# EAGLE schematic Electronics_Design_v1 v11 (EAGLE 9.7.0)
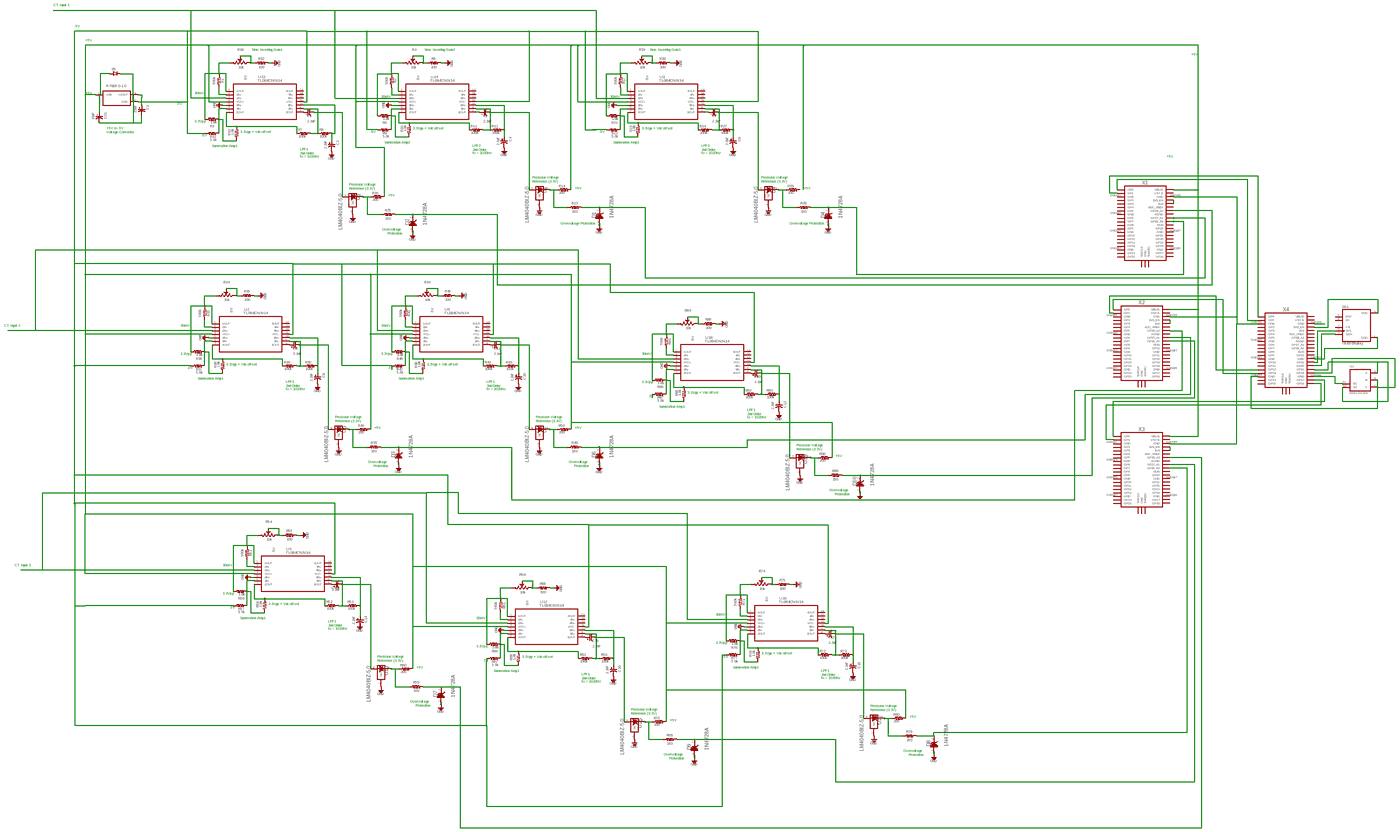
[diagram p0: schematic, sheet 1, overview]
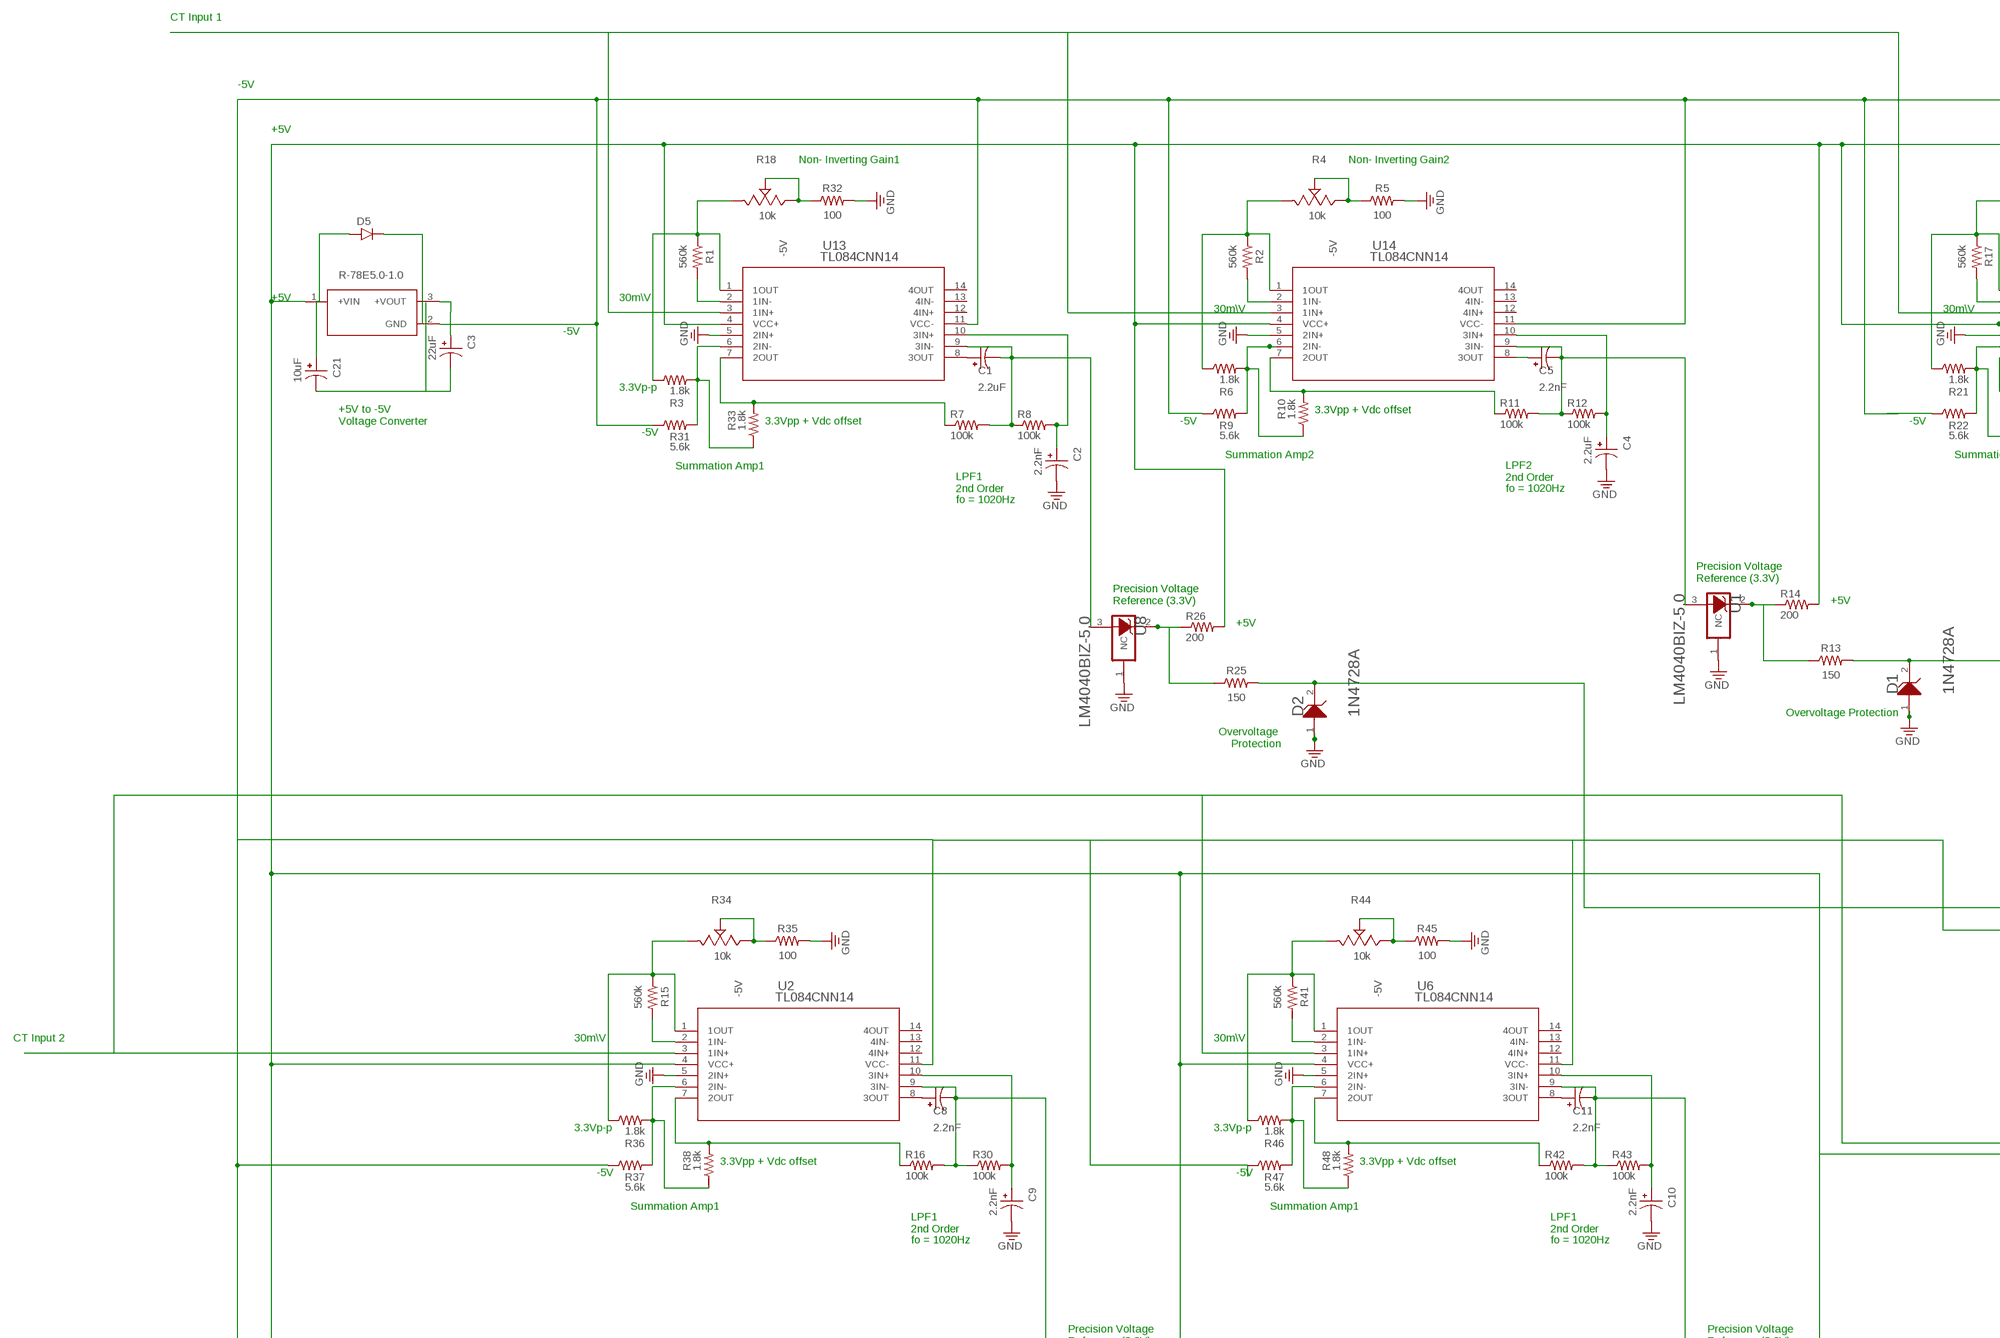
[diagram p1: schematic, sheet 1, part 1 of 6]
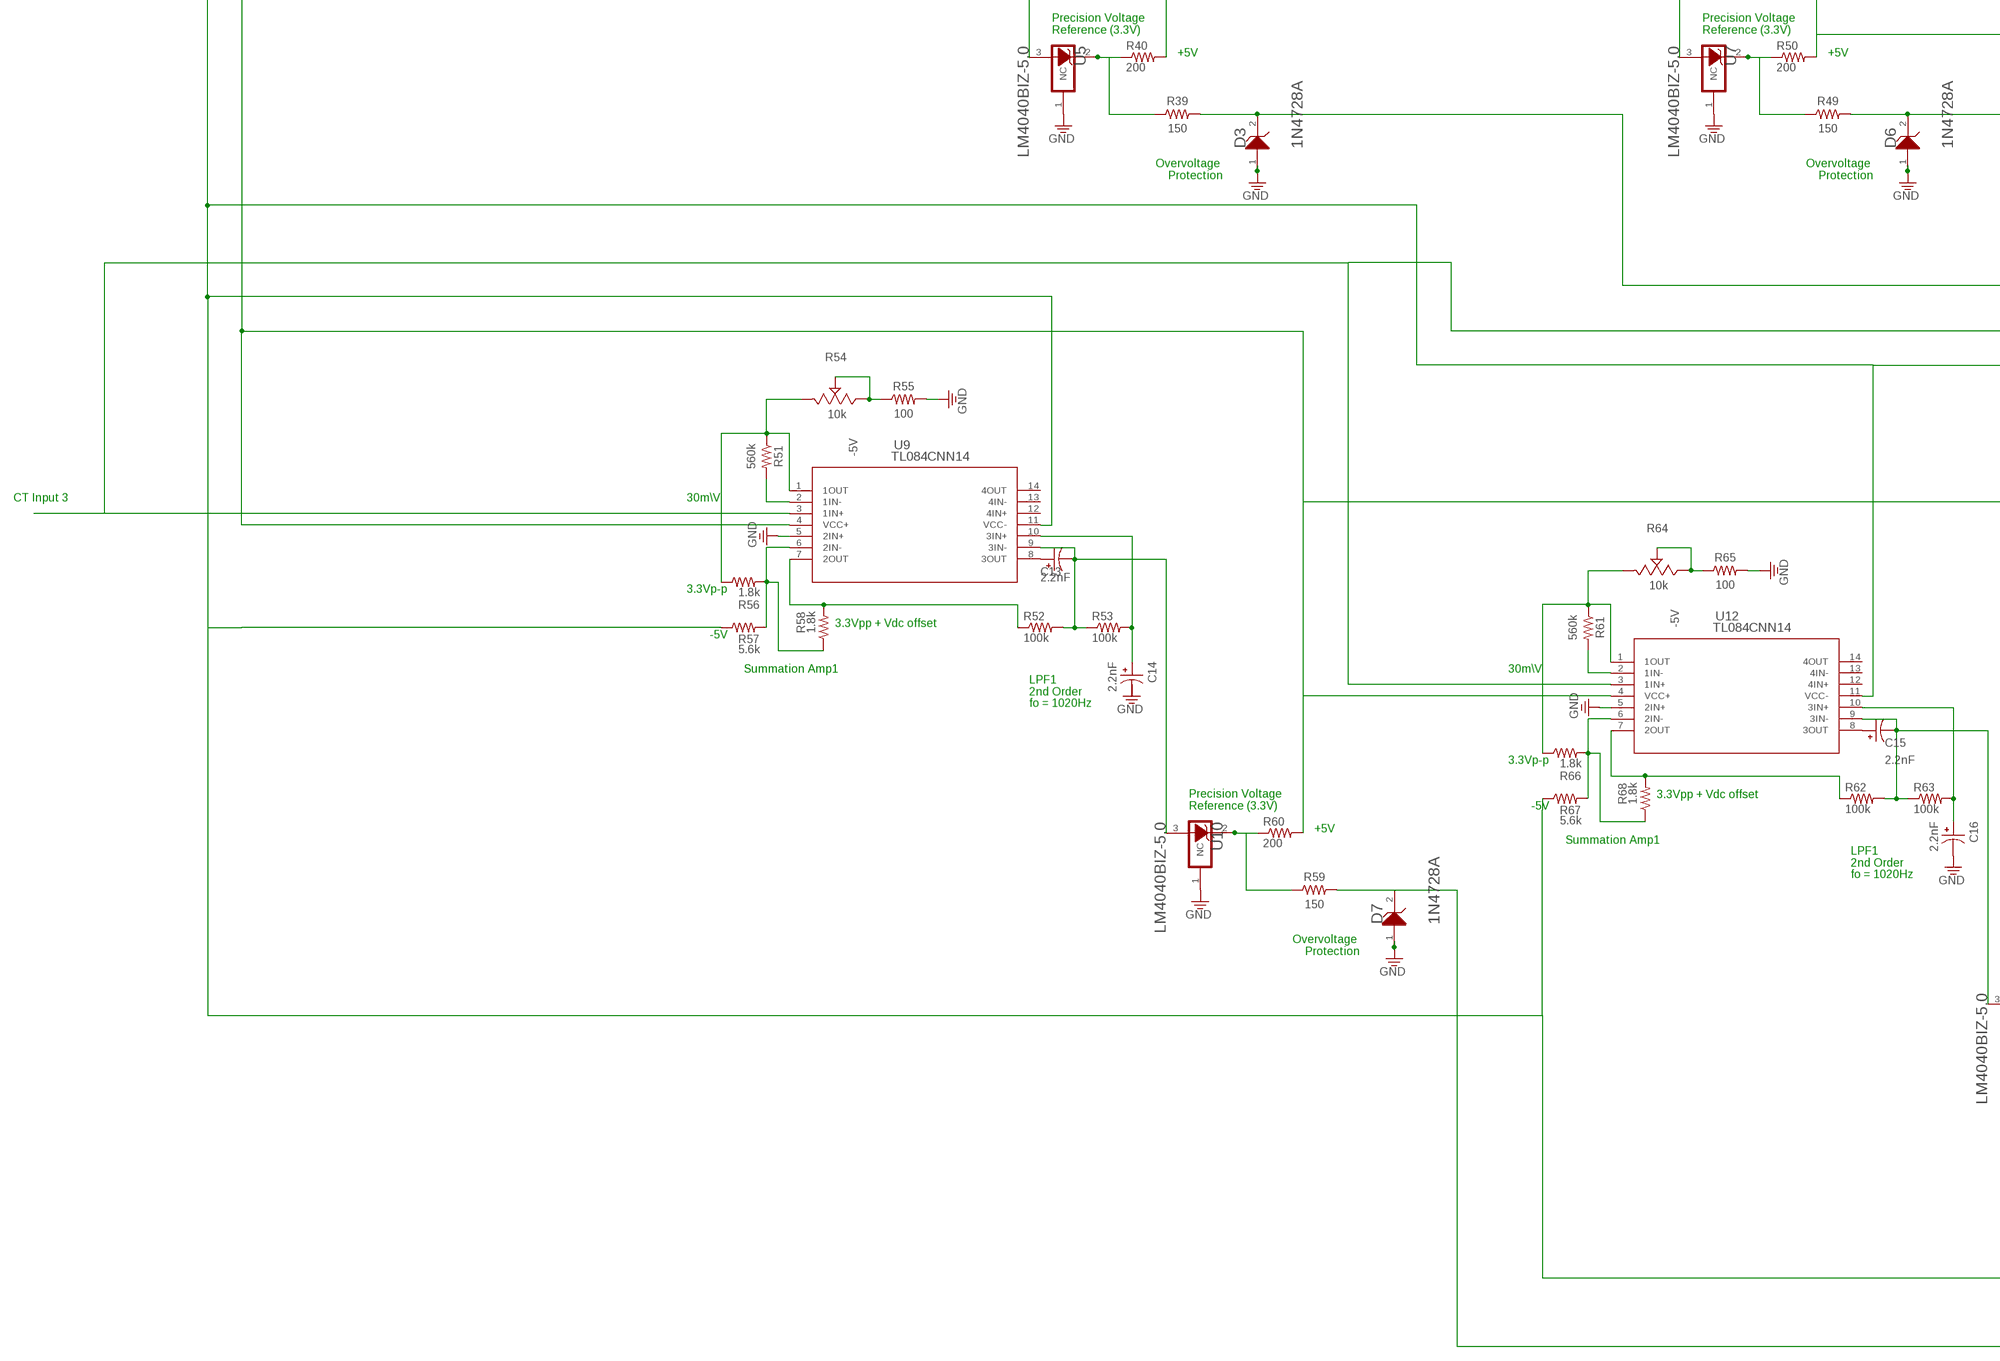
[diagram p2: schematic, sheet 1, part 2 of 6]
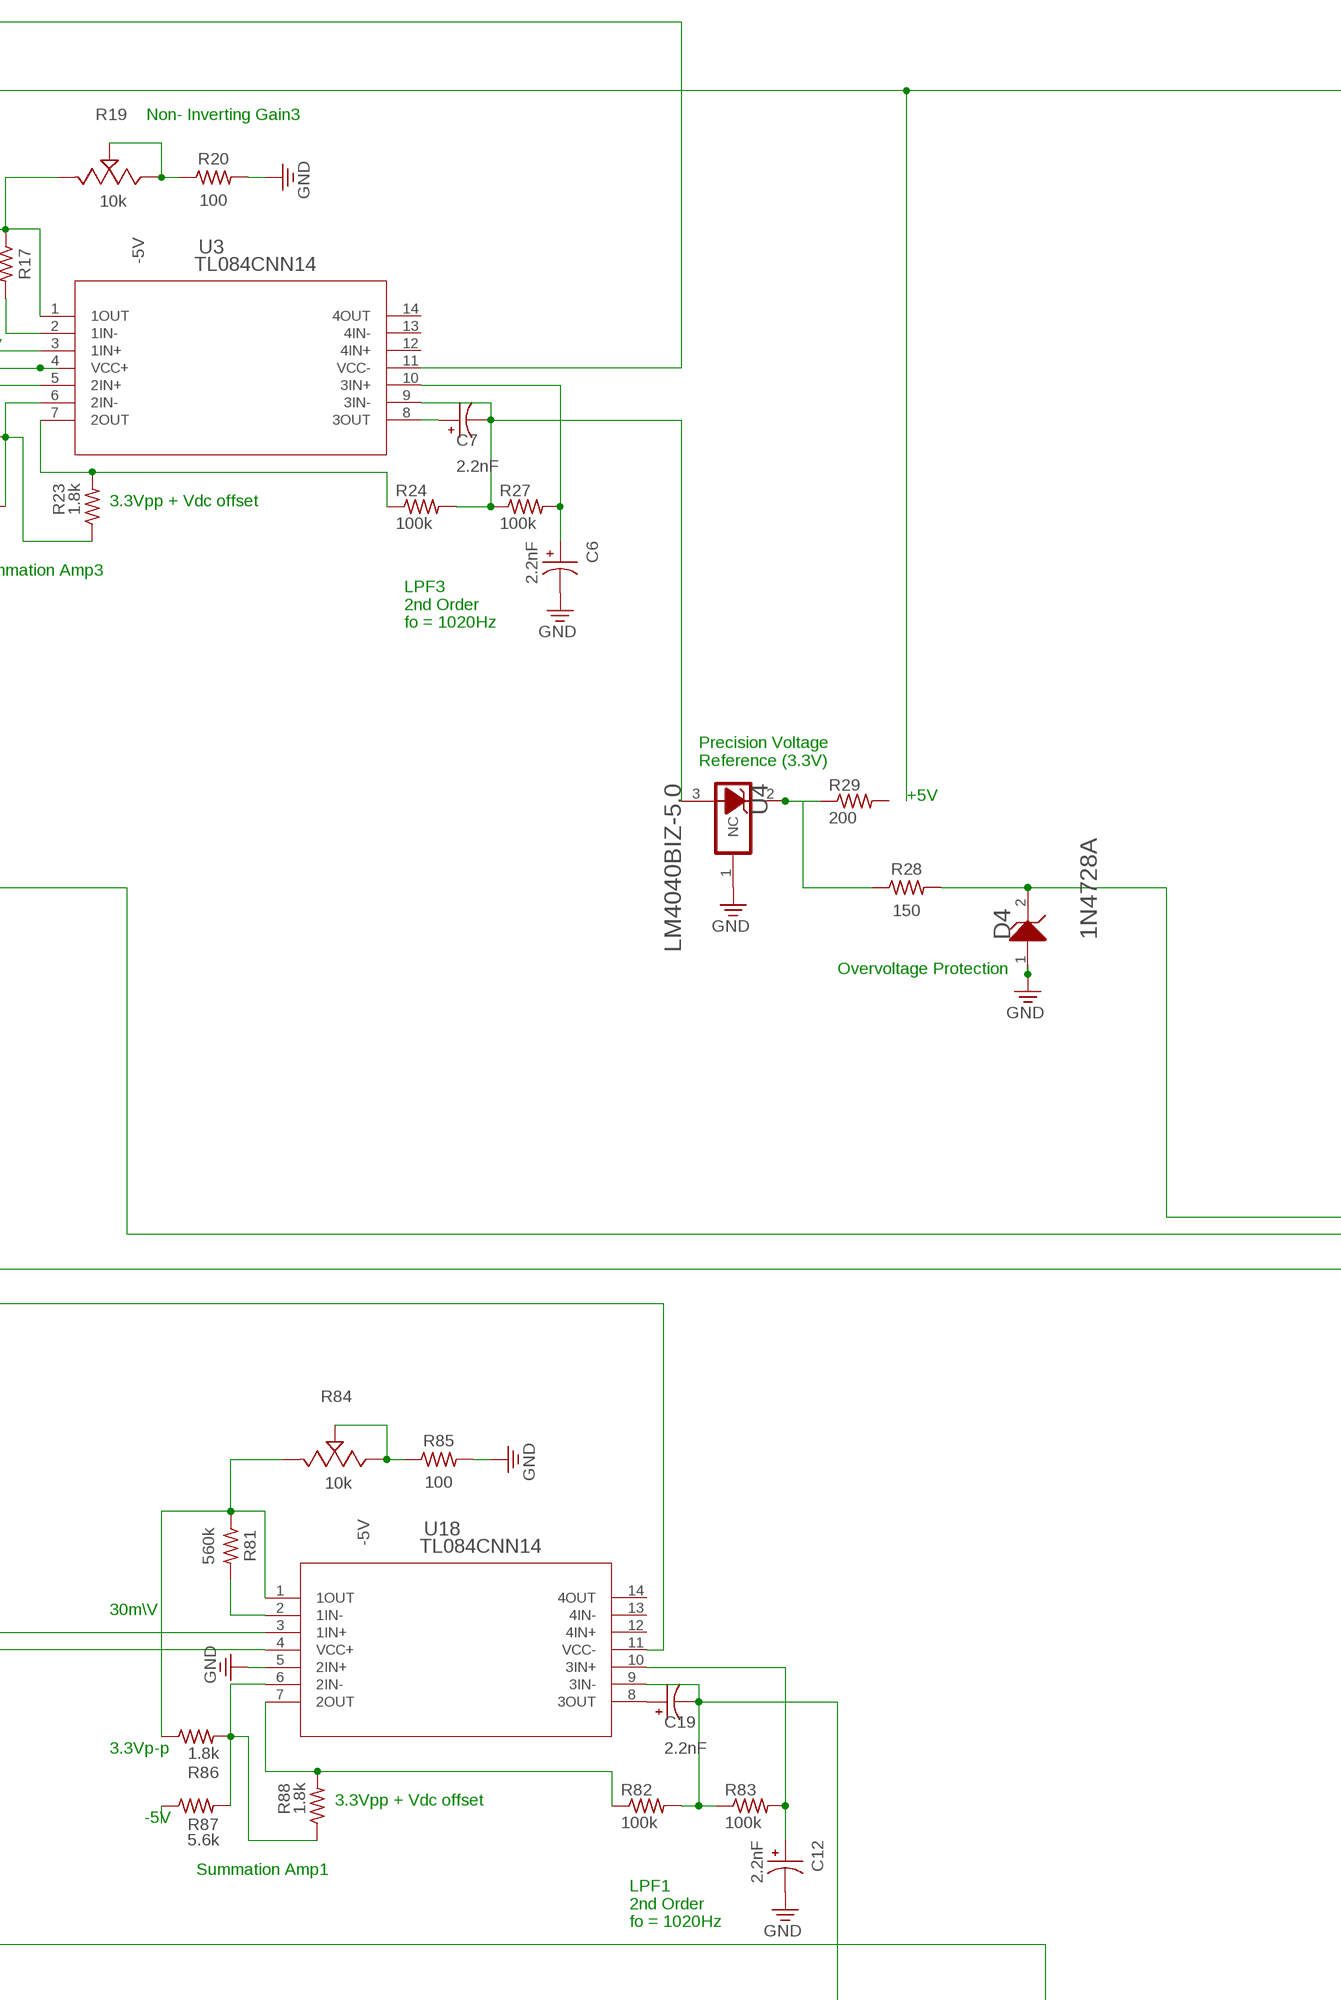
[diagram p3: schematic, sheet 1, part 3 of 6]
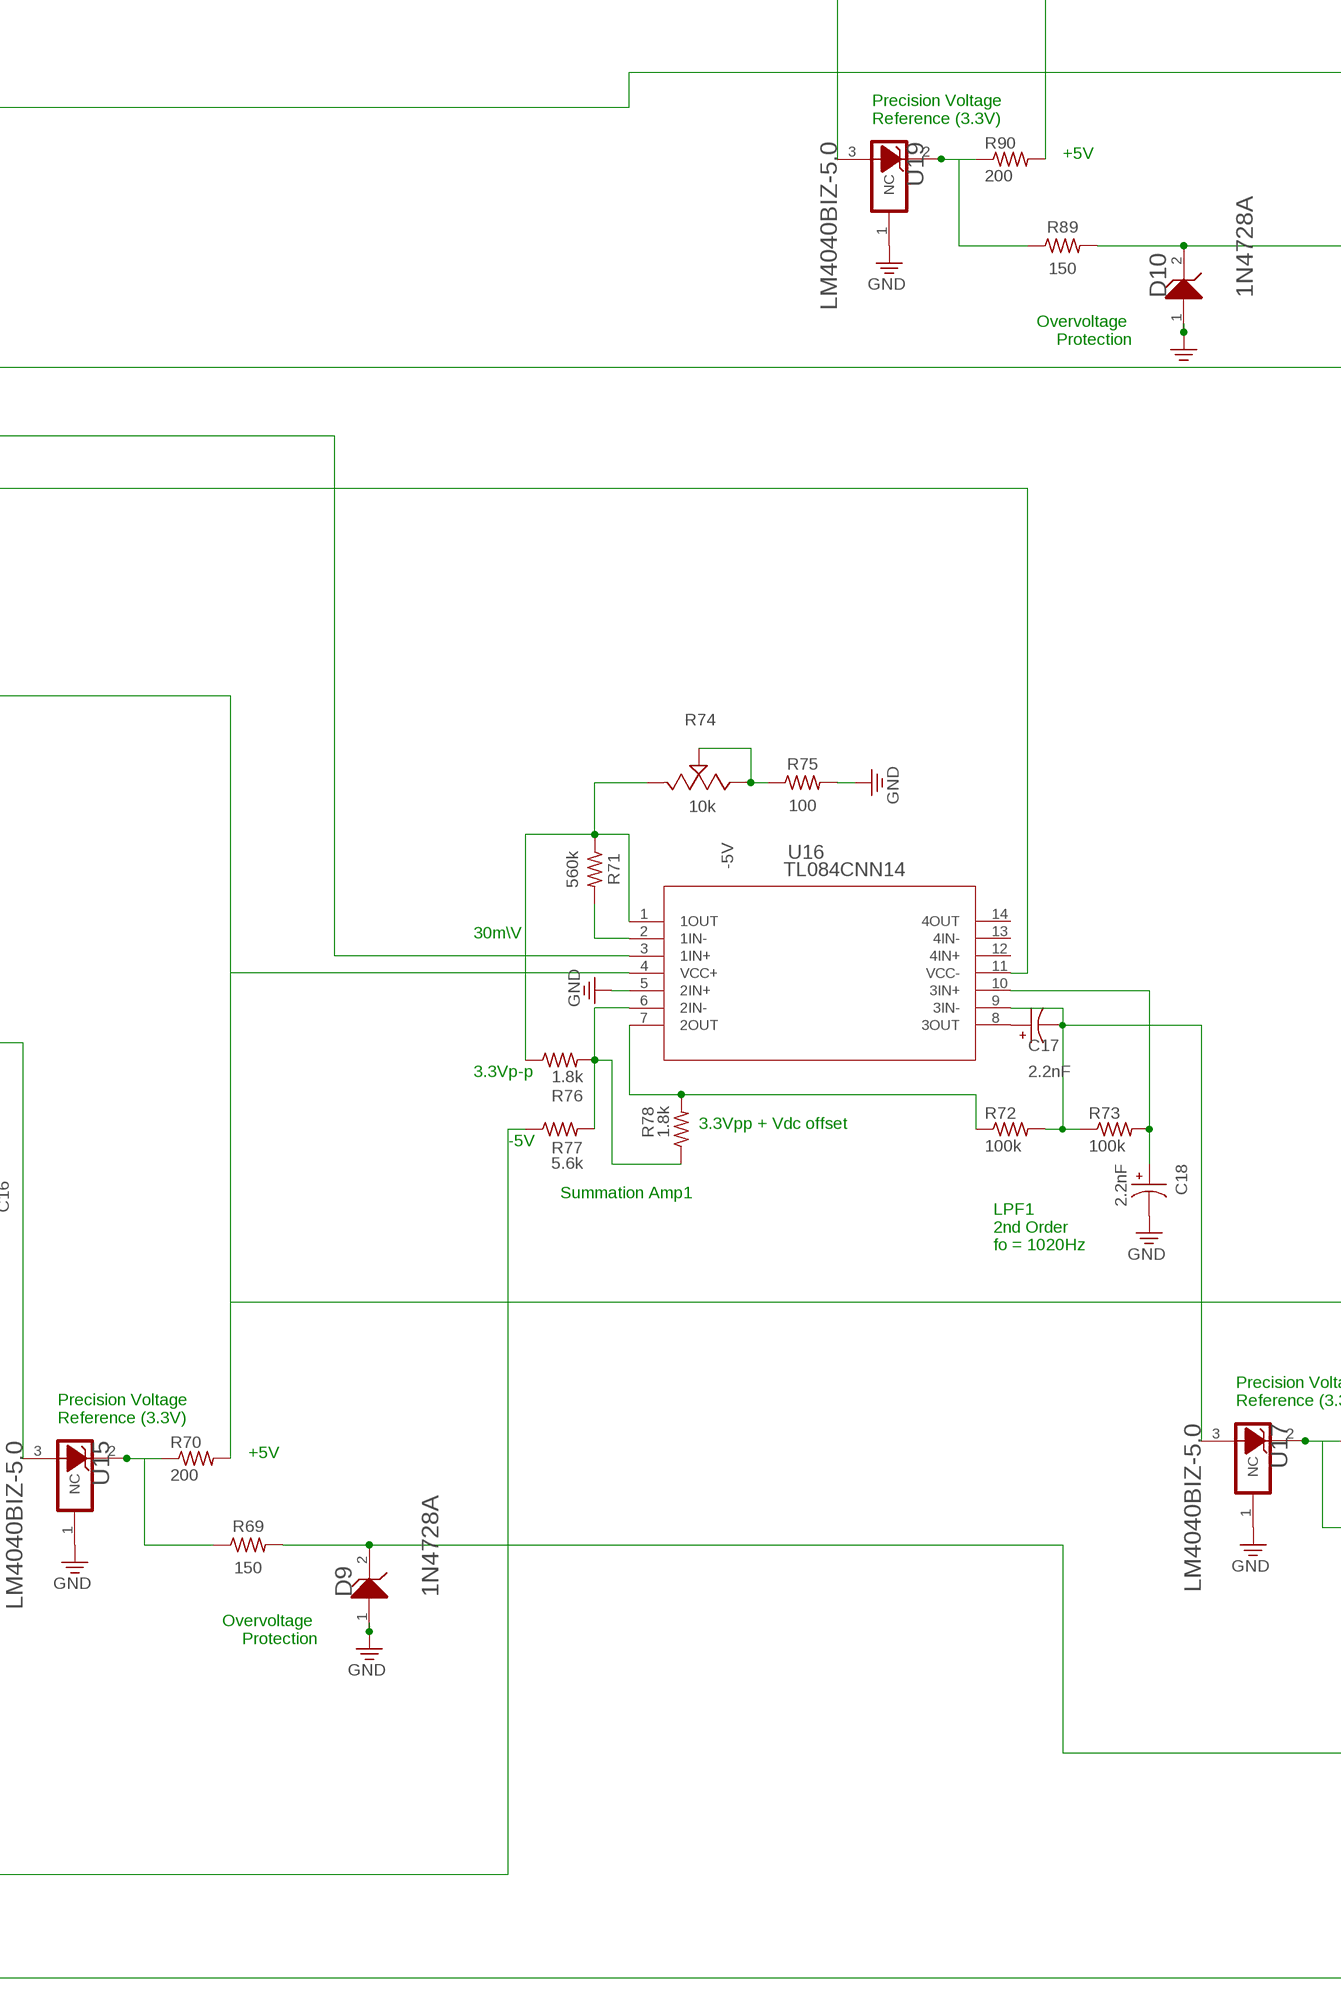
[diagram p4: schematic, sheet 1, part 4 of 6]
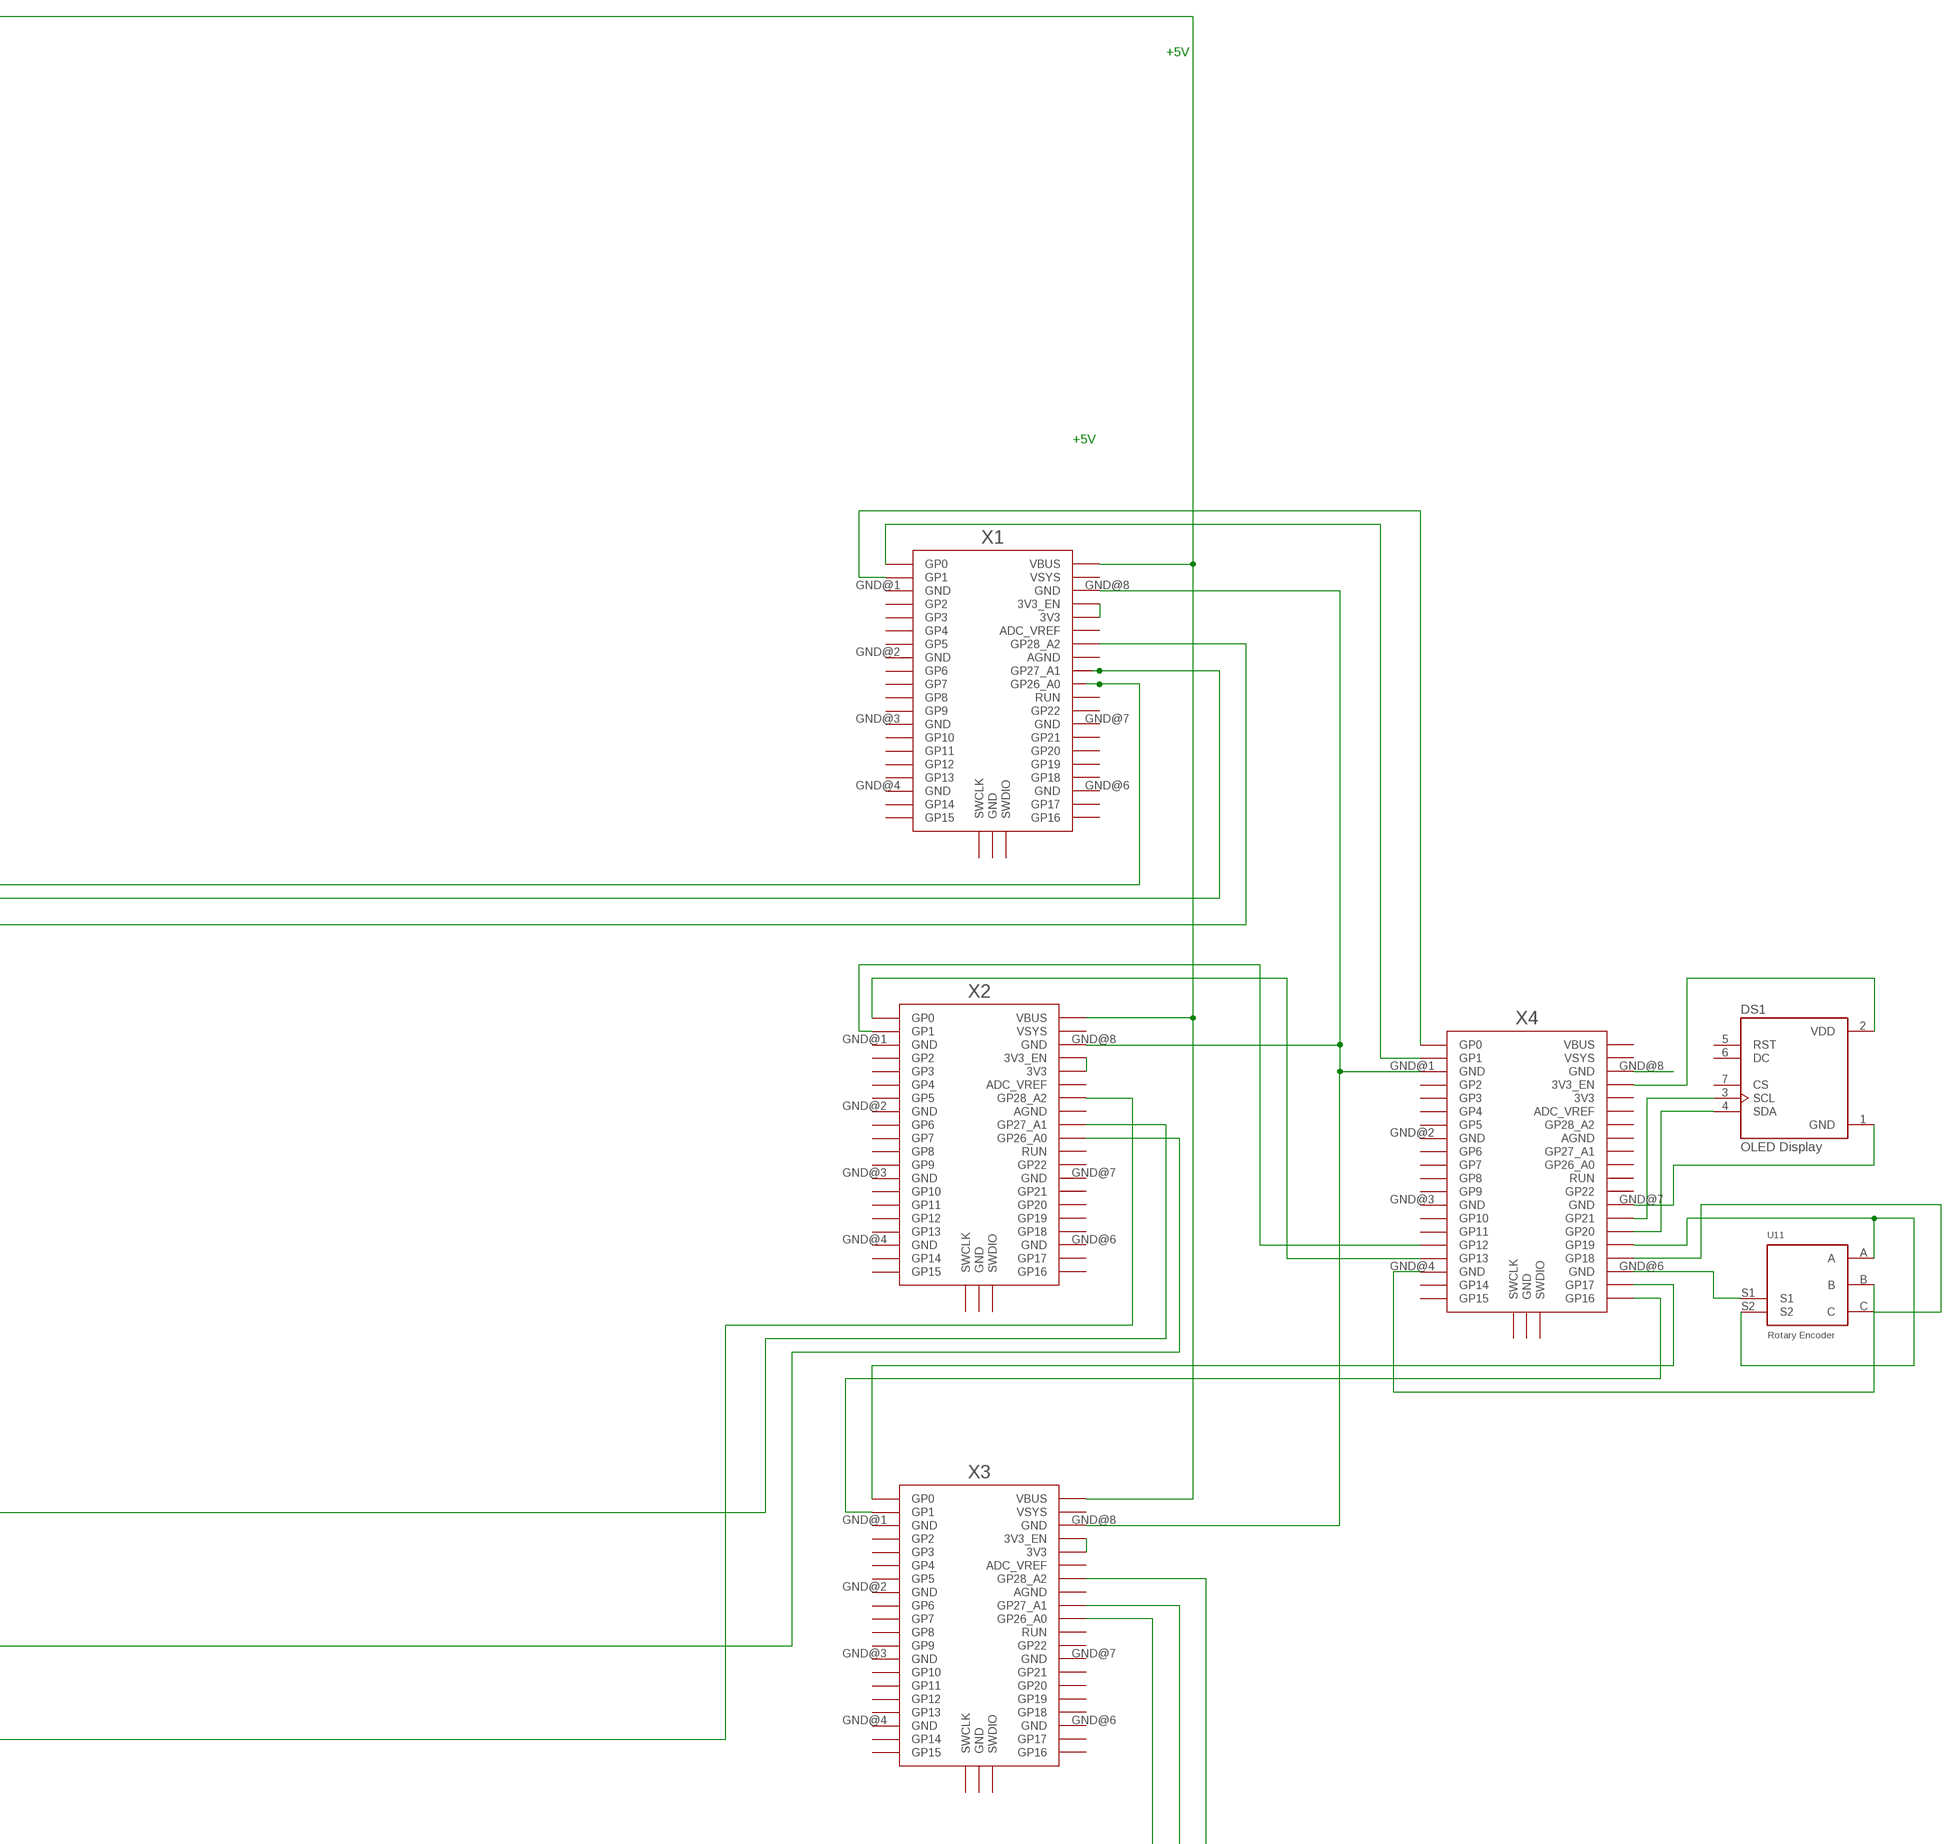
[diagram p5: schematic, sheet 1, part 5 of 6]
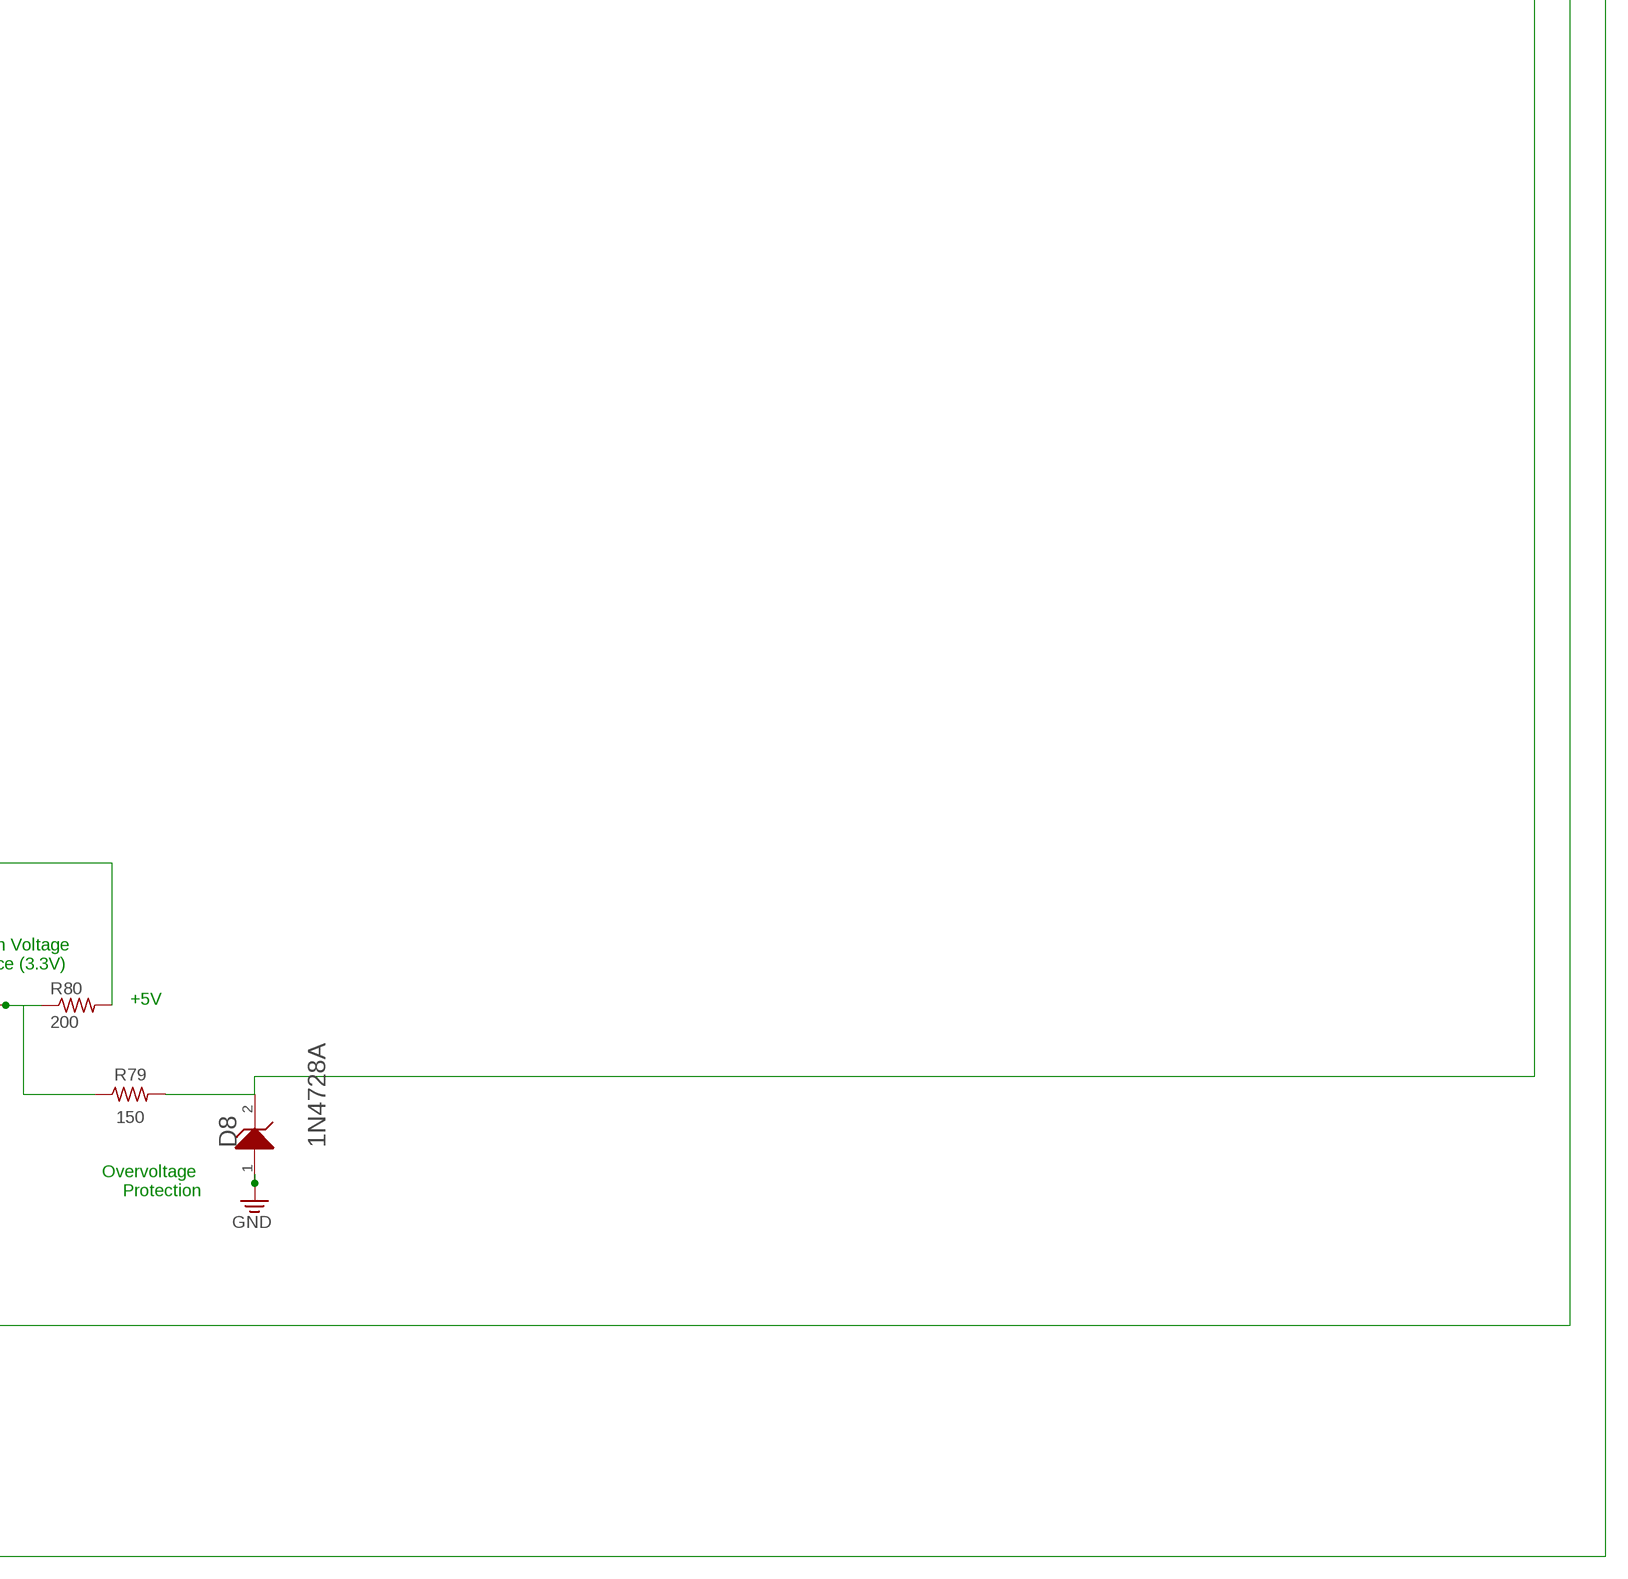
[diagram p6: schematic, sheet 1, part 6 of 6]

## Parts
C1  2.2uF  UPM2A100MED  [CAPPRD250W50D630H1250]
C2  2.2nF  UPM2A100MED  [CAPPRD250W50D630H1250]
C3  22uF  UPM2A100MED  [CAPPRD250W50D630H1250]
C4  2.2uF  UPM2A100MED  [CAPPRD250W50D630H1250]
C5  2.2nF  UPM2A100MED  [CAPPRD250W50D630H1250]
C6  2.2nF  UPM2A100MED  [CAPPRD250W50D630H1250]
C7  2.2nF  UPM2A100MED  [CAPPRD250W50D630H1250]
C8  2.2nF  UPM2A100MED  [CAPPRD250W50D630H1250]
C9  2.2nF  UPM2A100MED  [CAPPRD250W50D630H1250]
C10  2.2nF  UPM2A100MED  [CAPPRD250W50D630H1250]
C11  2.2nF  UPM2A100MED  [CAPPRD250W50D630H1250]
C12  2.2nF  UPM2A100MED  [CAPPRD250W50D630H1250]
C13  2.2nF  UPM2A100MED  [CAPPRD250W50D630H1250]
C14  2.2nF  UPM2A100MED  [CAPPRD250W50D630H1250]
C15  2.2nF  EEUFC1J101  [CAPPRD500W60D1000H1250]
C16  2.2nF  UPM2A100MED  [CAPPRD250W50D630H1250]
C17  2.2nF  UPM2A100MED  [CAPPRD250W50D630H1250]
C18  2.2nF  UPM2A100MED  [CAPPRD250W50D630H1250]
C19  2.2nF  UPM2A100MED  [CAPPRD250W50D630H1250]
C21  10uF  UPM2A100MED  [CAPPRD250W50D630H1250]
D1  FAIRCHILD_SEMICONDUCTOR_1N4728AFAIRCHILD_SEMICONDUCTOR_1N4728A_0_0  [FAIRCHILD_SEMICONDUCTOR_1N4728A_0]
D2  FAIRCHILD_SEMICONDUCTOR_1N4728AFAIRCHILD_SEMICONDUCTOR_1N4728A_0_0  [FAIRCHILD_SEMICONDUCTOR_1N4728A_0]
D3  FAIRCHILD_SEMICONDUCTOR_1N4728AFAIRCHILD_SEMICONDUCTOR_1N4728A_0_0  [FAIRCHILD_SEMICONDUCTOR_1N4728A_0]
D4  FAIRCHILD_SEMICONDUCTOR_1N4728AFAIRCHILD_SEMICONDUCTOR_1N4728A_0_0  [FAIRCHILD_SEMICONDUCTOR_1N4728A_0]
D5  1N914.4  [DO35-4]
D6  FAIRCHILD_SEMICONDUCTOR_1N4728AFAIRCHILD_SEMICONDUCTOR_1N4728A_0_0  [FAIRCHILD_SEMICONDUCTOR_1N4728A_0]
D7  FAIRCHILD_SEMICONDUCTOR_1N4728AFAIRCHILD_SEMICONDUCTOR_1N4728A_0_0  [FAIRCHILD_SEMICONDUCTOR_1N4728A_0]
D8  FAIRCHILD_SEMICONDUCTOR_1N4728AFAIRCHILD_SEMICONDUCTOR_1N4728A_0_0  [FAIRCHILD_SEMICONDUCTOR_1N4728A_0]
D9  FAIRCHILD_SEMICONDUCTOR_1N4728AFAIRCHILD_SEMICONDUCTOR_1N4728A_0_0  [FAIRCHILD_SEMICONDUCTOR_1N4728A_0]
D10  FAIRCHILD_SEMICONDUCTOR_1N4728AFAIRCHILD_SEMICONDUCTOR_1N4728A_0_0  [FAIRCHILD_SEMICONDUCTOR_1N4728A_0]
DS1  OLED Display  AOM12864A0-1.54WW-ANO  [LCD_AOM12864A0-1.54WW-ANO]
PS1  R-78E5.0-1.0  [CONV_R-78E5.0-1.0]
R1  560k  R-US_AXIAL-7.2MM-PITCH  [RESAD724W46L381D178B]
R2  560k  R-US_AXIAL-7.2MM-PITCH  [RESAD724W46L381D178B]
R3  1.8k  R-US_AXIAL-7.2MM-PITCH  [RESAD724W46L381D178B]
R4  10k  3362P-1-103LF  [3362P-1-103LF]
R5  100  R-US_AXIAL-7.2MM-PITCH  [RESAD724W46L381D178B]
R6  1.8k  R-US_AXIAL-7.2MM-PITCH  [RESAD724W46L381D178B]
R7  100k  R-US_AXIAL-7.2MM-PITCH  [RESAD724W46L381D178B]
R8  100k  R-US_AXIAL-7.2MM-PITCH  [RESAD724W46L381D178B]
R9  5.6k  R-US_AXIAL-7.2MM-PITCH  [RESAD724W46L381D178B]
R10  1.8k  R-US_AXIAL-7.2MM-PITCH  [RESAD724W46L381D178B]
R11  100k  R-US_AXIAL-7.2MM-PITCH  [RESAD724W46L381D178B]
R12  100k  R-US_AXIAL-7.2MM-PITCH  [RESAD724W46L381D178B]
R13  150  R-US_AXIAL-7.2MM-PITCH  [RESAD724W46L381D178B]
R14  200  R-US_AXIAL-7.2MM-PITCH  [RESAD724W46L381D178B]
R15  560k  R-US_AXIAL-7.2MM-PITCH  [RESAD724W46L381D178B]
R16  100k  R-US_AXIAL-7.2MM-PITCH  [RESAD724W46L381D178B]
R17  560k  R-US_AXIAL-7.2MM-PITCH  [RESAD724W46L381D178B]
R18  10k  3362P-1-103LF  [3362P-1-103LF]
R19  10k  3362P-1-103LF  [3362P-1-103LF]
R20  100  R-US_AXIAL-7.2MM-PITCH  [RESAD724W46L381D178B]
R21  1.8k  R-US_AXIAL-7.2MM-PITCH  [RESAD724W46L381D178B]
R22  5.6k  R-US_AXIAL-7.2MM-PITCH  [RESAD724W46L381D178B]
R23  1.8k  R-US_AXIAL-7.2MM-PITCH  [RESAD724W46L381D178B]
R24  100k  R-US_AXIAL-7.2MM-PITCH  [RESAD724W46L381D178B]
R25  150  R-US_AXIAL-7.2MM-PITCH  [RESAD724W46L381D178B]
R26  200  R-US_AXIAL-7.2MM-PITCH  [RESAD724W46L381D178B]
R27  100k  R-US_AXIAL-7.2MM-PITCH  [RESAD724W46L381D178B]
R28  150  R-US_AXIAL-7.2MM-PITCH  [RESAD724W46L381D178B]
R29  200  R-US_AXIAL-7.2MM-PITCH  [RESAD724W46L381D178B]
R30  100k  R-US_AXIAL-7.2MM-PITCH  [RESAD724W46L381D178B]
R31  5.6k  R-US_AXIAL-7.2MM-PITCH  [RESAD724W46L381D178B]
R32  100  R-US_AXIAL-7.2MM-PITCH  [RESAD724W46L381D178B]
R33  1.8k  R-US_AXIAL-7.2MM-PITCH  [RESAD724W46L381D178B]
R34  10k  3362P-1-103LF  [3362P-1-103LF]
R35  100  R-US_AXIAL-7.2MM-PITCH  [RESAD724W46L381D178B]
R36  1.8k  R-US_AXIAL-7.2MM-PITCH  [RESAD724W46L381D178B]
R37  5.6k  R-US_AXIAL-7.2MM-PITCH  [RESAD724W46L381D178B]
R38  1.8k  R-US_AXIAL-7.2MM-PITCH  [RESAD724W46L381D178B]
R39  150  R-US_AXIAL-7.2MM-PITCH  [RESAD724W46L381D178B]
R40  200  R-US_AXIAL-7.2MM-PITCH  [RESAD724W46L381D178B]
R41  560k  R-US_AXIAL-7.2MM-PITCH  [RESAD724W46L381D178B]
R42  100k  R-US_AXIAL-7.2MM-PITCH  [RESAD724W46L381D178B]
R43  100k  R-US_AXIAL-7.2MM-PITCH  [RESAD724W46L381D178B]
R44  10k  3362P-1-103LF  [3362P-1-103LF]
R45  100  R-US_AXIAL-7.2MM-PITCH  [RESAD724W46L381D178B]
R46  1.8k  R-US_AXIAL-7.2MM-PITCH  [RESAD724W46L381D178B]
R47  5.6k  R-US_AXIAL-7.2MM-PITCH  [RESAD724W46L381D178B]
R48  1.8k  R-US_AXIAL-7.2MM-PITCH  [RESAD724W46L381D178B]
R49  150  R-US_AXIAL-7.2MM-PITCH  [RESAD724W46L381D178B]
R50  200  R-US_AXIAL-7.2MM-PITCH  [RESAD724W46L381D178B]
R51  560k  R-US_AXIAL-7.2MM-PITCH  [RESAD724W46L381D178B]
R52  100k  R-US_AXIAL-7.2MM-PITCH  [RESAD724W46L381D178B]
R53  100k  R-US_AXIAL-7.2MM-PITCH  [RESAD724W46L381D178B]
R54  10k  3362P-1-103LF  [3362P-1-103LF]
R55  100  R-US_AXIAL-7.2MM-PITCH  [RESAD724W46L381D178B]
R56  1.8k  R-US_AXIAL-7.2MM-PITCH  [RESAD724W46L381D178B]
R57  5.6k  R-US_AXIAL-7.2MM-PITCH  [RESAD724W46L381D178B]
R58  1.8k  R-US_AXIAL-7.2MM-PITCH  [RESAD724W46L381D178B]
R59  150  R-US_AXIAL-7.2MM-PITCH  [RESAD724W46L381D178B]
R60  200  R-US_AXIAL-7.2MM-PITCH  [RESAD724W46L381D178B]
R61  560k  R-US_AXIAL-7.2MM-PITCH  [RESAD724W46L381D178B]
R62  100k  R-US_AXIAL-7.2MM-PITCH  [RESAD724W46L381D178B]
R63  100k  R-US_AXIAL-7.2MM-PITCH  [RESAD724W46L381D178B]
R64  10k  3362P-1-103LF  [3362P-1-103LF]
R65  100  R-US_AXIAL-7.2MM-PITCH  [RESAD724W46L381D178B]
R66  1.8k  R-US_AXIAL-7.2MM-PITCH  [RESAD724W46L381D178B]
R67  5.6k  R-US_AXIAL-7.2MM-PITCH  [RESAD724W46L381D178B]
R68  1.8k  R-US_AXIAL-7.2MM-PITCH  [RESAD724W46L381D178B]
R69  150  R-US_AXIAL-7.2MM-PITCH  [RESAD724W46L381D178B]
R70  200  R-US_AXIAL-7.2MM-PITCH  [RESAD724W46L381D178B]
R71  560k  R-US_AXIAL-7.2MM-PITCH  [RESAD724W46L381D178B]
R72  100k  R-US_AXIAL-7.2MM-PITCH  [RESAD724W46L381D178B]
R73  100k  R-US_AXIAL-7.2MM-PITCH  [RESAD724W46L381D178B]
R74  10k  3362P-1-103LF  [3362P-1-103LF]
R75  100  R-US_AXIAL-7.2MM-PITCH  [RESAD724W46L381D178B]
R76  1.8k  R-US_AXIAL-7.2MM-PITCH  [RESAD724W46L381D178B]
R77  5.6k  R-US_AXIAL-7.2MM-PITCH  [RESAD724W46L381D178B]
R78  1.8k  R-US_AXIAL-7.2MM-PITCH  [RESAD724W46L381D178B]
R79  150  R-US_AXIAL-7.2MM-PITCH  [RESAD724W46L381D178B]
R80  200  R-US_AXIAL-7.2MM-PITCH  [RESAD724W46L381D178B]
R81  560k  R-US_AXIAL-7.2MM-PITCH  [RESAD724W46L381D178B]
R82  100k  R-US_AXIAL-7.2MM-PITCH  [RESAD724W46L381D178B]
R83  100k  R-US_AXIAL-7.2MM-PITCH  [RESAD724W46L381D178B]
R84  10k  3362P-1-103LF  [3362P-1-103LF]
R85  100  R-US_AXIAL-7.2MM-PITCH  [RESAD724W46L381D178B]
R86  1.8k  R-US_AXIAL-7.2MM-PITCH  [RESAD724W46L381D178B]
R87  5.6k  R-US_AXIAL-7.2MM-PITCH  [RESAD724W46L381D178B]
R88  1.8k  R-US_AXIAL-7.2MM-PITCH  [RESAD724W46L381D178B]
R89  150  R-US_AXIAL-7.2MM-PITCH  [RESAD724W46L381D178B]
R90  200  R-US_AXIAL-7.2MM-PITCH  [RESAD724W46L381D178B]
U1  TI_NATIONAL_SEMICONDUCTOR_LM4040BIZ-5.0TI_NATIONAL_SEMICONDUCTOR_LM4040BIZ-5.0_0_0  [TI_NATIONAL_SEMICONDUCTOR_LM4040BIZ-5.0_0]
U2  TL084CNN14  [N14]
U3  TL084CNN14  [N14]
U4  TI_NATIONAL_SEMICONDUCTOR_LM4040BIZ-5.0TI_NATIONAL_SEMICONDUCTOR_LM4040BIZ-5.0_0_0  [TI_NATIONAL_SEMICONDUCTOR_LM4040BIZ-5.0_0]
U5  TI_NATIONAL_SEMICONDUCTOR_LM4040BIZ-5.0TI_NATIONAL_SEMICONDUCTOR_LM4040BIZ-5.0_0_0  [TI_NATIONAL_SEMICONDUCTOR_LM4040BIZ-5.0_0]
U6  TL084CNN14  [N14]
U7  TI_NATIONAL_SEMICONDUCTOR_LM4040BIZ-5.0TI_NATIONAL_SEMICONDUCTOR_LM4040BIZ-5.0_0_0  [TI_NATIONAL_SEMICONDUCTOR_LM4040BIZ-5.0_0]
U8  TI_NATIONAL_SEMICONDUCTOR_LM4040BIZ-5.0TI_NATIONAL_SEMICONDUCTOR_LM4040BIZ-5.0_0_0  [TI_NATIONAL_SEMICONDUCTOR_LM4040BIZ-5.0_0]
U9  TL084CNN14  [N14]
U10  TI_NATIONAL_SEMICONDUCTOR_LM4040BIZ-5.0TI_NATIONAL_SEMICONDUCTOR_LM4040BIZ-5.0_0_0  [TI_NATIONAL_SEMICONDUCTOR_LM4040BIZ-5.0_0]
U11  Rotary Encoder  ACZ11BR1E-20FD1-20C  [CUI_ACZ11BR1E-20FD1-20C]
U12  TL084CNN14  [N14]
U13  TL084CNN14  [N14]
U14  TL084CNN14  [N14]
U15  TI_NATIONAL_SEMICONDUCTOR_LM4040BIZ-5.0TI_NATIONAL_SEMICONDUCTOR_LM4040BIZ-5.0_0_0  [TI_NATIONAL_SEMICONDUCTOR_LM4040BIZ-5.0_0]
U16  TL084CNN14  [N14]
U17  TI_NATIONAL_SEMICONDUCTOR_LM4040BIZ-5.0TI_NATIONAL_SEMICONDUCTOR_LM4040BIZ-5.0_0_0  [TI_NATIONAL_SEMICONDUCTOR_LM4040BIZ-5.0_0]
U18  TL084CNN14  [N14]
U19  TI_NATIONAL_SEMICONDUCTOR_LM4040BIZ-5.0TI_NATIONAL_SEMICONDUCTOR_LM4040BIZ-5.0_0_0  [TI_NATIONAL_SEMICONDUCTOR_LM4040BIZ-5.0_0]
X1  Piico Pi  RPI_PICO_IG-TH  [RPI_PICO_TH]
X2  RPI_PICO_IG-TH  [RPI_PICO_TH]
X3  RPI_PICO_IG-TH  [RPI_PICO_TH]
X4  RPI_PICO_IG-TH  [RPI_PICO_TH]

## Nets
+5V2: PS1.1(+VIN) R14.2 R26.2 R40.2 R50.2 R57.1 R60.2 R70.2 R80.2 R90.2 U2.4(VCC+) U3.4(VCC+) U6.4(VCC+) U9.4(VCC+) U12.4(VCC+) U13.4(VCC+) U14.4(VCC+) U16.4(VCC+) U18.4(VCC+) X1.VBUS X2.VBUS X3.VBUS
-5V: PS1.2(GND) R9.1 R31.1 R37.1 R47.1 R77.1 U2.11(VCC-) U3.11(VCC-) U6.11(VCC-) U9.11(VCC-) U12.11(VCC-) U13.11(VCC-) U14.11(VCC-) U16.11(VCC-) U18.11(VCC-)
GND: C2.N C4.N C6.N C9.N C10.N C12.N C16.N C18.N D1.1(A) D2.1(A) D3.1(A) D4.1(A) D6.1(A) D7.1(A) D8.1(A) D9.1(A) D10.1(A) R5.2 R20.2 R32.2 R35.2 R45.2 R55.2 R65.2 R75.2 R85.2 U1.1(NC) U2.5(2IN+) U3.5(2IN+) U4.1(NC) U5.1(NC) U6.5(2IN+) U7.1(NC) U8.1(NC) U9.5(2IN+) U10.1(NC) U12.5(2IN+) U13.5(2IN+) U14.5(2IN+) U15.1(NC) U16.5(2IN+) U17.1(NC) U18.5(2IN+) U19.1(NC)
N$1: C5.P U14.8(3OUT)
N$2: R1.2 U13.2(1IN-)
N$3: C1.N R7.2 R8.1 U8.3(-V) U13.9(3IN-)
N$4: R4.2 R4.3 R5.1
N$5: R2.2 U14.2(1IN-)
N$6: R2.1 R4.1 R6.1 U14.1(1OUT)
N$7: R6.2 R9.2 R10.1 U14.6(2IN-)
N$8: C1.P U13.8(3OUT)
N$9: C5.N R11.2 R12.1 U1.3(-V) U14.9(3IN-)
N$10: D2.2(K) R25.2 X1.GP28_A2
N$11: R22.1
N$12: X2.3V3 X2.3V3_EN
N$13: C4.P R12.2 U14.10(3IN+)
N$14: R13.1 R14.1 U1.2(+V)
N$15: C21.P D5.A
N$16: C3.N
N$17: D5.C
N$18: C21.N
N$19: C3.P PS1.3(+VOUT)
N$20: R10.2 R11.1 U14.7(2OUT)
N$21: C6.P R27.2 U3.10(3IN+)
N$22: U2.3(1IN+) U6.3(1IN+) U18.3(1IN+)
N$23: D1.2(K) R13.2 X1.GP27_A1
N$24: R19.2 R19.3 R20.1
N$25: R17.2 U3.2(1IN-)
N$26: R17.1 R19.1 R21.1 U3.1(1OUT)
N$27: R21.2 R22.2 R23.1 U3.6(2IN-)
N$28: R23.2 R24.1 U3.7(2OUT)
N$29: R15.2 U2.2(1IN-)
N$30: C7.N R24.2 R27.1 U3.9(3IN-) U4.3(-V)
N$31: C7.P U3.8(3OUT)
N$32: X3.3V3 X3.3V3_EN
N$33: C9.P R30.2 U2.10(3IN+)
N$34: R28.1 R29.1 U4.2(+V)
N$35: D4.2(K) R28.2 X1.GP26_A0
N$36: R15.1 R34.1 R36.1 U2.1(1OUT)
N$37: R34.2 R34.3 R35.1
N$38: R36.2 R37.2 R38.1 U2.6(2IN-)
N$39: R16.1 R38.2 U2.7(2OUT)
N$40: C8.N R16.2 R30.1 U2.9(3IN-) U5.3(-V)
N$41: C10.P R43.2 U6.10(3IN+)
N$42: C8.P U2.8(3OUT)
N$43: R39.1 R40.1 U5.2(+V)
N$44: U9.3(1IN+) U12.3(1IN+) U16.3(1IN+)
N$45: C11.P U6.8(3OUT)
N$46: C19.P U18.8(3OUT)
N$47: C13.P U9.8(3OUT)
N$48: R41.2 U6.2(1IN-)
N$49: R25.1 R26.1 U8.2(+V)
N$50: X1.3V3 X1.3V3_EN
N$51: R41.1 R44.1 R46.1 U6.1(1OUT)
N$52: R44.2 R44.3 R45.1
N$53: D3.2(K) R39.2 X2.GP28_A2
N$54: R46.2 R47.2 R48.1 U6.6(2IN-)
N$55: X1.GP0 X4.GP1
N$56: R42.1 R48.2 U6.7(2OUT)
N$57: X1.GP1 X4.GP0
N$58: X1.GND@8(GND) X2.GND@8(GND) X3.GND@8(GND) X4.GND@1(GND)
N$59: X2.GP0 X4.GP13
N$60: X2.GP1 X4.GP12
N$61: X3.GP0 X4.GP17
N$62: X3.GP1 X4.GP16
N$63: U11.S1 X4.GND@6(GND)
N$64: U11.A U11.S2 X4.GP19
N$65: U11.C X4.GP18
N$66: U11.B X4.GND@4(GND)
N$67: DS1.2(VDD) X4.3V3_EN
N$68: DS1.1(GND) X4.GND@7(GND)
N$69: DS1.4(SDA) X4.GP20
N$70: DS1.3(SCL) X4.GP21
N$71: X4.GND@8(GND)
N$72: C11.N R42.2 R43.1 U6.9(3IN-) U7.3(-V)
N$73: U3.3(1IN+) U13.3(1IN+) U14.3(1IN+)
N$74: R1.1 R3.1 R18.1 U13.1(1OUT)
N$75: R18.2 R18.3 R32.1
N$76: R3.2 R31.2 R33.1 U13.6(2IN-)
N$77: R7.1 R33.2 U13.7(2OUT)
N$78: C12.P R83.2 U18.10(3IN+)
N$79: C2.P R8.2 U13.10(3IN+)
N$80: R49.1 R50.1 U7.2(+V)
N$81: D6.2(K) R49.2 X2.GP27_A1
N$82: C17.P U16.8(3OUT)
N$83: R71.2 U16.2(1IN-)
N$84: R51.2 U9.2(1IN-)
N$85: R51.1 R54.1 R56.1 U9.1(1OUT)
N$86: R54.2 R54.3 R55.1
N$87: R56.2 R57.2 R58.1 U9.6(2IN-)
N$88: R52.1 R58.2 U9.7(2OUT)
N$89: C13.N R52.2 R53.1 U9.9(3IN-) U10.3(-V)
N$90: C16.P R63.2 U12.10(3IN+)
N$91: C14.P R53.2 U9.10(3IN+)
N$92: R59.1 R60.1 U10.2(+V)
N$93: D7.2(K) R59.2 X3.GP28_A2
N$94: R71.1 R74.1 R76.1 U16.1(1OUT)
N$95: C15.N R62.2 R63.1 U12.9(3IN-) U15.3(-V)
N$96: R61.2 U12.2(1IN-)
N$97: R61.1 R64.1 R66.1 U12.1(1OUT)
N$98: R64.2 R64.3 R65.1
N$99: R66.2 R67.2 R68.1 U12.6(2IN-)
N$100: R62.1 R68.2 U12.7(2OUT)
N$101: C18.P R73.2 U16.10(3IN+)
N$103: C15.P U12.8(3OUT)
N$104: R69.1 R70.1 U15.2(+V)
N$105: D9.2(K) R69.2 X3.GP27_A1
N$106: R67.1
N$108: R74.2 R74.3 R75.1
N$109: R76.2 R77.2 R78.1 U16.6(2IN-)
N$110: R72.1 R78.2 U16.7(2OUT)
N$111: C17.N R72.2 R73.1 U16.9(3IN-) U17.3(-V)
N$114: R79.1 R80.1 U17.2(+V)
N$115: D8.2(K) R79.2 X3.GP26_A0
N$118: R81.2 U18.2(1IN-)
N$119: R81.1 R84.1 R86.1 U18.1(1OUT)
N$120: R84.2 R84.3 R85.1
N$121: R86.2 R87.2 R88.1 U18.6(2IN-)
N$122: R82.1 R88.2 U18.7(2OUT)
N$123: C19.N R82.2 R83.1 U18.9(3IN-) U19.3(-V)
N$126: R89.1 R90.1 U19.2(+V)
N$127: D10.2(K) R89.2 X2.GP26_A0
N$128: R87.1
Unconnected: C14.N DS1.5(RST) DS1.6(DC) DS1.7(CS) R29.2 U2.12(4IN+) U2.13(4IN-) U2.14(4OUT) U3.12(4IN+) U3.13(4IN-) U3.14(4OUT) U6.12(4IN+) U6.13(4IN-) U6.14(4OUT) U9.12(4IN+) U9.13(4IN-) U9.14(4OUT) U12.12(4IN+) U12.13(4IN-) U12.14(4OUT) U13.12(4IN+) U13.13(4IN-) U13.14(4OUT) U14.12(4IN+) U14.13(4IN-) U14.14(4OUT) U16.12(4IN+) U16.13(4IN-) U16.14(4OUT) U18.12(4IN+) U18.13(4IN-) U18.14(4OUT) X1.ADC_VREF X1.AGND X1.GND@1(GND) X1.GND@2(GND) X1.GND@3(GND) X1.GND@4(GND) X1.GND@5(GND) X1.GND@6(GND) X1.GND@7(GND) X1.GP2 X1.GP3 X1.GP4 X1.GP5 X1.GP6 X1.GP7 X1.GP8 X1.GP9 X1.GP10 X1.GP11 X1.GP12 X1.GP13 X1.GP14 X1.GP15 X1.GP16 X1.GP17 X1.GP18 X1.GP19 X1.GP20 X1.GP21 X1.GP22 X1.RUN X1.SWCLK X1.SWDIO X1.VSYS X2.ADC_VREF X2.AGND X2.GND@1(GND) X2.GND@2(GND) X2.GND@3(GND) X2.GND@4(GND) X2.GND@5(GND) X2.GND@6(GND) X2.GND@7(GND) X2.GP2 X2.GP3 X2.GP4 X2.GP5 X2.GP6 X2.GP7 X2.GP8 X2.GP9 X2.GP10 X2.GP11 X2.GP12 X2.GP13 X2.GP14 X2.GP15 X2.GP16 X2.GP17 X2.GP18 X2.GP19 X2.GP20 X2.GP21 X2.GP22 X2.RUN X2.SWCLK X2.SWDIO X2.VSYS X3.ADC_VREF X3.AGND X3.GND@1(GND) X3.GND@2(GND) X3.GND@3(GND) X3.GND@4(GND) X3.GND@5(GND) X3.GND@6(GND) X3.GND@7(GND) X3.GP2 X3.GP3 X3.GP4 X3.GP5 X3.GP6 X3.GP7 X3.GP8 X3.GP9 X3.GP10 X3.GP11 X3.GP12 X3.GP13 X3.GP14 X3.GP15 X3.GP16 X3.GP17 X3.GP18 X3.GP19 X3.GP20 X3.GP21 X3.GP22 X3.RUN X3.SWCLK X3.SWDIO X3.VSYS X4.3V3 X4.ADC_VREF X4.AGND X4.GND@2(GND) X4.GND@3(GND) X4.GND@5(GND) X4.GP2 X4.GP3 X4.GP4 X4.GP5 X4.GP6 X4.GP7 X4.GP8 X4.GP9 X4.GP10 X4.GP11 X4.GP14 X4.GP15 X4.GP22 X4.GP26_A0 X4.GP27_A1 X4.GP28_A2 X4.RUN X4.SWCLK X4.SWDIO X4.VBUS X4.VSYS

## Buses
B$1
N$44
-5V
B$3

## Notes on the sheet
- CT Input 1
- -5V
- +5V
- Non- Inverting Gain1 | Non- Inverting Gain2 | Non- Inverting Gain3
- +5V
- +5V | 30m\V
- 30m\V | 30m\V
- -5V
- 3.3Vp-p
- 3.3Vpp + Vdc offset | 3.3Vpp + Vdc offset
- +5V to -5V
  Voltage Converter
- 3.3Vpp + Vdc offset | -5V | -5V
- -5V
- Summation Amp2 | Summation Amp3
- Summation Amp1
- LPF2
  2nd Order
- LPF3
  2nd Order
- LPF1
  2nd Order
- fo = 1020Hz | fo = 1020Hz
- fo = 1020Hz | +5V
- Precision Voltage      
  Reference (3.3V)
- Precision Voltage      
  Reference (3.3V)
- Precision Voltage      
  Reference (3.3V)
- +5V | +5V
- +5V
- Overvoltage Protection | Overvoltage Protection
- Overvoltage 
  Protection
- CT Input 2 | 30m\V | 30m\V
- 3.3Vp-p | 3.3Vp-p | 30m\V
- 3.3Vpp + Vdc offset | 3.3Vpp + Vdc offset
- -5V | -5V
- Summation Amp1 | Summation Amp1
- 3.3Vp-p
- LPF1
  2nd Order
- LPF1
  2nd Order
- fo = 1020Hz | fo = 1020Hz
- 3.3Vpp + Vdc offset
- -5V
- Summation Amp1
- LPF1
  2nd Order
- fo = 1020Hz
- Precision Voltage      
  Reference (3.3V)
- Precision Voltage      
  Reference (3.3V)
- +5V | +5V
- Precision Voltage      
  Reference (3.3V)
- +5V
- Overvoltage 
  Protection
- Overvoltage 
  Protection
- Overvoltage 
  Protection
- CT Input 3 | 30m\V
- 3.3Vp-p
- 3.3Vpp + Vdc offset
- -5V
- 30m\V
- Summation Amp1 | 30m\V
- LPF1
  2nd Order
- fo = 1020Hz
- 3.3Vp-p
- 3.3Vp-p
- 3.3Vpp + Vdc offset
- 3.3Vpp + Vdc offset | -5V
- Precision Voltage      
  Reference (3.3V)
- -5V
- +5V | Summation Amp1
- Summation Amp1
- LPF1
  2nd Order
- LPF1
  2nd Order
- fo = 1020Hz
- fo = 1020Hz
- Overvoltage 
  Protection
- Precision Voltage      
  Reference (3.3V)
- Precision Voltage      
  Reference (3.3V)
- +5V
- +5V
- Overvoltage 
  Protection
- Overvoltage 
  Protection

## Library data of the parts
C1-C14 C16-C19 C21 = UPM2A100MED:UPM2A100MED: CAP ALUM 10UF 20% 100V RADIAL; A_MAX: 12.5; B_MAX: 0.5; B_NOM: 0.5; DESCRIPTION: CAP ALUM 10UF 20% 100V RADIAL; D_NOM: 6.3; E_NOM: 2.5; MF: NICHICON
C15 = EEUFC1J101:EEUFC1J101: FC-A; A_MAX: 12.5; B_MAX: 0.65; B_NOM: 0.6; DESCRIPTION: FC-A; D_NOM: 10; E_NOM: 5; MF: PANASONIC; PARTREV: 20-DEC-19
D1-D4 D6-D10 = Fairchild Semiconductor - 1N4728A:FAIRCHILD_SEMICONDUCTOR_1N4728A: FAIR-DZEN-A1K2-2; COMPONENT_LINK_1_DESCRIPTION: Manufacturer URL; COMPONENT_LINK_1_URL: http://www.fairchildsemi.com/; COMPONENT_LINK_3_DESCRIPTION: Package Specification; COMPONENT_LINK_3_URL: http://www.fairchildsemi.com/dwg/DO/DO41A.pdf; DATASHEET: http://www.fairchildsemi.com/ds/1N/1N4744A.pdf; DATASHEET_VERSION: Rev. H3; FOOTPRINT_VARIANT_NAME_0: Manufacturer Recommended; IMPORTED: yes; IMPORTED_FROM: vault; IMPORT_TS: 1521843604; IR_UA: 100; MF: Fairchild Semiconductor; MOUNTING_TECHNOLOGY: Through Hole; MPN: 1N4728A; OPERATING_AND_STORAGE_TEMPERATURE_RANGE: -65 to 200 degC; PACKAGE: DO-41-2; PACKAGE_DESCRIPTION: 2-Pin Axial leaded, Body 2.72 x 5.2 mm, Lead Spread 25.4 mm; PACKAGE_VERSION: Rev. 2; PD_W: 1; PREFIX: D; RELEASE_DATE: 1396598095; ROHS: Yes; TEST_CURRENT_IZ_MA: 76; TOLERANCE: 5%; VAULT_GUID: BB5BB100-3A3D-49B5-B4BA-51B09125605A; VAULT_REVISION: 7D3D7113-8068-4E65-AD6A-1728C093E95D; VZ_MAX_V: 3.465; VZ_MIN_V: 3.135; ZZ_MAX_OHM: 10
D5 = 1N914:1N914: Fast Switching Diode DO-35 glass case a.k.a. 1N4148
DS1 = AOM12864A0-1.54WW-ANO:AOM12864A0-1.54WW-ANO: Non-Touch Graphic LCD Display Module - White OLED SPI 1.54in (39.12mm) 128 x 64; MANUFACTURER: Orient Display; MAXIMUM_PACKAGE_HEIGHT: 5.5mm; PARTREV: O; STANDARD: Manufacturer Recommendations
PS1 = R-78E5.0-1.0:R-78E5.0-1.0: 1.0 Amp SIP3 Single Output; MANUFACTURER: RECOM; MAXIMUM_PACKAGE_HEIGHT: 10.40mm; PARTREV: 6; STANDARD: Manufacturer Recommendations
R1 R2 R5 R13 R15 R17 R20 R25 R28 R32 R35 R39 R41 R45 R49 R51 R55 R59 R61 R65 R69 R71 R75 R79 R81 R85 R89 = Resistor:R-US: Resistor Fixed - ANSI; CATEGORY: Resistor; SUB-CATEGORY: Fixed
R3 R6-R12 R14 R16 R21-R24 R26 R27 R29-R31 R33 R36-R38 R40 R42 R43 R46-R48 R50 R52 R53 R56-R58 R60 R62 R63 R66-R68 R70 R72 R73 R76-R78 R80 R82 R83 R86-R88 R90 = Tutorial - Fusion 360:R-US: Resistor Fixed - ANSI; CATEGORY: Resistor; SUB-CATEGORY: Fixed
R4 R18 R19 R34 R44 R54 R64 R74 R84 = Potentiometer_Trimmers:3362P-1-103LF: TRIMMER 10K OHM 0.5W PC PIN TOP Manufacturer's datasheet <https://www.bourns.com/docs/Product-Datasheets/3362.pdf>; CREATED_PN: PCBLayout.com; DIGIKEY_PN: 3362P-103LF-ND; MANUFACTURER: Bourns Inc.; MPN: 3362P-1-103LF
U1 U4 U5 U7 U8 U10 U15 U17 U19 = TI National Semiconductor - LM4040BIZ-5.0:TI_NATIONAL_SEMICONDUCTOR_LM4040BIZ-5.0: PM-REF-LM113-IL3A; CODE__JEDEC: TO-226-AA; COMPONENT_LINK_1_DESCRIPTION: LM4040 Datasheet; COMPONENT_LINK_1_URL: http://www.national.com/ds/LM/LM4040.pdf; COMPONENT_LINK_2_DESCRIPTION: LM4040 Web Page; COMPONENT_LINK_2_URL: http://www.national.com/pf/LM/LM4040.html; COMPONENT_LINK_3_DESCRIPTION: Z03A Package Page; COMPONENT_LINK_3_URL: http://www.national.com/packaging/folders/z03a.html; COMP_TYPE: Voltage Reference IC; DATASHEET_VERSION: Apr-2005; IMPORTED: yes; IMPORTED_FROM: vault; IMPORT_TS: 1521180609; MF: TI National Semiconductor; MPN: LM4040BIZ-5.0; PACKAGE: Z03A; PACKAGE_DESCRIPTION: TO-92, Molded, 3 Lead; PACKAGE_TOP_MARKING: NSXYTT*4040B*IZ5.0; PACKAGE_VERSION: revG, Sep-2000; PIN_COUNT: 3; POWER_WISE: N; PREFIX: U; ROHS: No; VAULT_GUID: CCAAE809-EA0A-4F87-952E-8A300FF63A12; VAULT_REVISION: 709C3BE3-EA26-41DE-880D-F4C7CBE28450
U2 U3 U6 U9 U12-U14 U16 U18 = 2023-02-17_00-49-57_Library:TL084CN; COPYRIGHT: Copyright (C) 2023 Ultra Librarian. All rights reserved.; MANUFACTURER_PART_NUMBER: TL084CN; MFR_NAME: Texas Instruments
U11 = ACZ11BR1E-20FD1-20C:ACZ11BR1E-20FD1-20C: 11 mm, 12 ~ 20 PPR, Through Hole, Mechanical Panel Mount Encoder; MANUFACTURER: CUI Devices; MAXIMUM_PACKAGE_HEIGHT: 26.5mm; PARTREV: 1.02; STANDARD: Manufacturer Recommendations
X1-X4 = RaspberryPi_Pico:RPI_PICO_IG